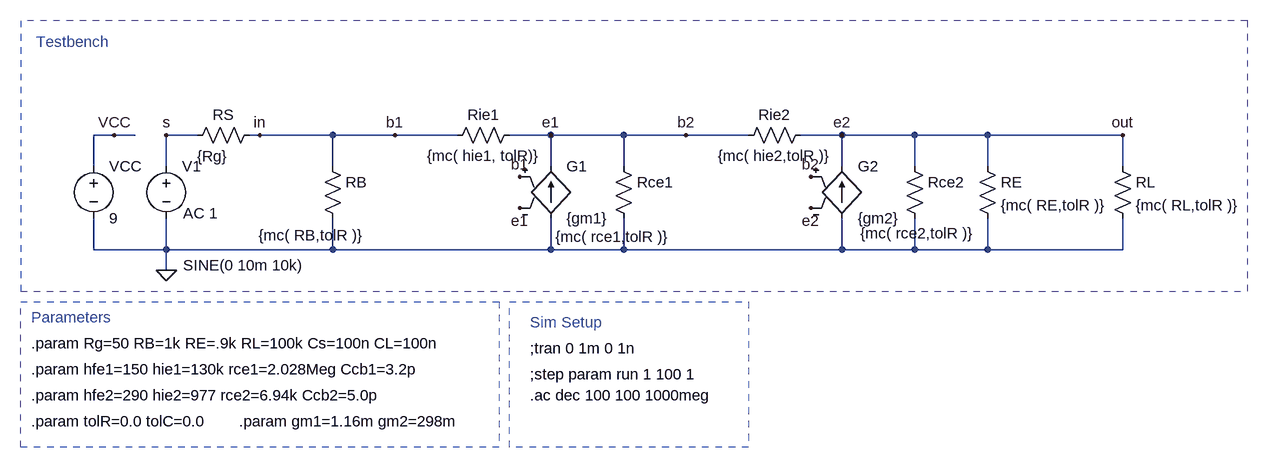
[diagram p0: schematic tb_f_med.asc]
tb_f_med.asc, the LTspice schematic file:
Version 4
SHEET 1 1348 680
WIRE -464 -224 -496 -224
WIRE -432 -224 -464 -224
WIRE -336 -224 -384 -224
WIRE -240 -224 -256 -224
WIRE -128 -224 -240 -224
WIRE -32 -224 -128 -224
WIRE 64 -224 -32 -224
WIRE 208 -224 144 -224
WIRE 320 -224 208 -224
WIRE 416 -224 320 -224
WIRE 512 -224 416 -224
WIRE 656 -224 592 -224
WIRE 768 -224 656 -224
WIRE 880 -224 768 -224
WIRE 1088 -224 880 -224
WIRE -496 -176 -496 -224
WIRE -384 -176 -384 -224
WIRE -128 -176 -128 -224
WIRE 208 -176 208 -224
WIRE 320 -176 320 -224
WIRE 656 -176 656 -224
WIRE 768 -176 768 -224
WIRE 880 -176 880 -224
WIRE 1088 -176 1088 -224
WIRE -496 -48 -496 -96
WIRE -384 -48 -384 -96
WIRE -384 -48 -496 -48
WIRE -128 -48 -128 -96
WIRE -128 -48 -384 -48
WIRE 208 -48 208 -96
WIRE 208 -48 -128 -48
WIRE 320 -48 320 -96
WIRE 320 -48 208 -48
WIRE 656 -48 656 -96
WIRE 656 -48 320 -48
WIRE 768 -48 768 -96
WIRE 768 -48 656 -48
WIRE 880 -48 880 -96
WIRE 880 -48 768 -48
WIRE 1088 -48 1088 -96
WIRE 1088 -48 880 -48
WIRE -384 -16 -384 -48
FLAG -384 -16 0
FLAG 1088 -224 out
FLAG -240 -224 in
FLAG -384 -224 s
FLAG -464 -224 VCC
FLAG -32 -224 b1
FLAG 416 -224 b2
FLAG 208 -224 e1
FLAG 656 -224 e2
FLAG 160 -160 b1
FLAG 160 -112 e1
FLAG 608 -160 b2
FLAG 608 -112 e2
SYMBOL voltage -384 -192 R0
WINDOW 3 26 168 Left 2
WINDOW 123 26 88 Left 2
WINDOW 39 0 0 Left 0
SYMATTR Value SINE(0 10m 10k)
SYMATTR Value2 AC 1
SYMATTR InstName V1
SYMBOL voltage -496 -192 R0
WINDOW 123 0 0 Left 0
WINDOW 39 0 0 Left 0
SYMATTR InstName VCC
SYMATTR Value 9
SYMBOL res -352 -208 R270
WINDOW 0 32 56 VTop 2
WINDOW 3 -1 39 VBottom 2
SYMATTR InstName RS
SYMATTR Value {Rg}
SYMBOL res -144 -192 R0
WINDOW 3 -98 122 Left 2
SYMATTR Value {mc( RB,tolR )}
SYMATTR InstName RB
SYMBOL res 48 -208 R270
WINDOW 0 32 56 VTop 2
WINDOW 3 0 56 VBottom 2
SYMATTR InstName Rie1
SYMATTR Value {mc( hie1, tolR)}
SYMBOL res 304 -192 R0
WINDOW 3 -89 124 Left 2
SYMATTR Value {mc( rce1,tolR )}
SYMATTR InstName Rce1
SYMBOL res 496 -208 R270
WINDOW 0 32 56 VTop 2
WINDOW 3 0 56 VBottom 2
SYMATTR InstName Rie2
SYMATTR Value {mc( hie2,tolR )}
SYMBOL res 752 -192 R0
WINDOW 3 -68 119 Left 2
SYMATTR Value {mc( rce2,tolR )}
SYMATTR InstName Rce2
SYMBOL res 864 -192 R0
SYMATTR InstName RE
SYMATTR Value {mc( RE,tolR )}
SYMBOL res 1072 -192 R0
SYMATTR InstName RL
SYMATTR Value {mc( RL,tolR )}
SYMBOL g 208 -192 R0
SYMATTR InstName G1
SYMATTR Value {gm1}
SYMBOL g 656 -192 R0
SYMATTR InstName G2
SYMATTR Value {gm2}
TEXT -584 -368 Left 2 ;Testbench
TEXT -592 56 Left 2 ;Parameters
TEXT -592 96 Left 2 !.param Rg=50 RB=1k RE=.9k RL=100k Cs=100n CL=100n
TEXT -592 136 Left 2 !.param hfe1=150 hie1=130k rce1=2.028Meg Ccb1=3.2p
TEXT -592 176 Left 2 !.param hfe2=290 hie2=977 rce2=6.94k Ccb2=5.0p
TEXT -592 216 Left 2 !.param tolR=0.0 tolC=0.0
TEXT 176 64 Left 2 ;Sim Setup
TEXT 176 104 Left 2 !;tran 0 1m 0 1n
TEXT 176 144 Left 2 !;step param run 1 100 1
TEXT 176 176 Left 2 !.ac dec 100 100 1000meg
TEXT -272 216 Left 2 !.param gm1=1.16m gm2=298m
RECTANGLE Normal 128 256 -608 32 2
RECTANGLE Normal 512 256 144 32 2
RECTANGLE Normal 1280 -400 -608 16 2

The netlist it stands for:
* tb_f_med.asc
V1 s 0 SINE(0 10m 10k) AC 1
VCC VCC 0 9
RS s b1 {Rg}
RB b1 0 {mc( RB,tolR )}
Rie1 b1 e1 {mc( hie1, tolR)}
Rce1 e1 0 {mc( rce1,tolR )}
Rie2 e1 e2 {mc( hie2,tolR )}
Rce2 e2 0 {mc( rce2,tolR )}
RE e2 0 {mc( RE,tolR )}
RL e2 0 {mc( RL,tolR )}
G1 0 e1 b1 e1 {gm1}
G2 0 e2 e1 e2 {gm2}
* Testbench
* Parameters
.param Rg=50 RB=1k RE=.9k RL=100k Cs=100n CL=100n
.param hfe1=150 hie1=130k rce1=2.028Meg Ccb1=3.2p
.param hfe2=290 hie2=977 rce2=6.94k Ccb2=5.0p
.param tolR=0.0 tolC=0.0
* Sim Setup
;tran 0 1m 0 1n
;step param run 1 100 1
.ac dec 100 100 1000meg
.param gm1=1.16m gm2=298m
.backanno
.end